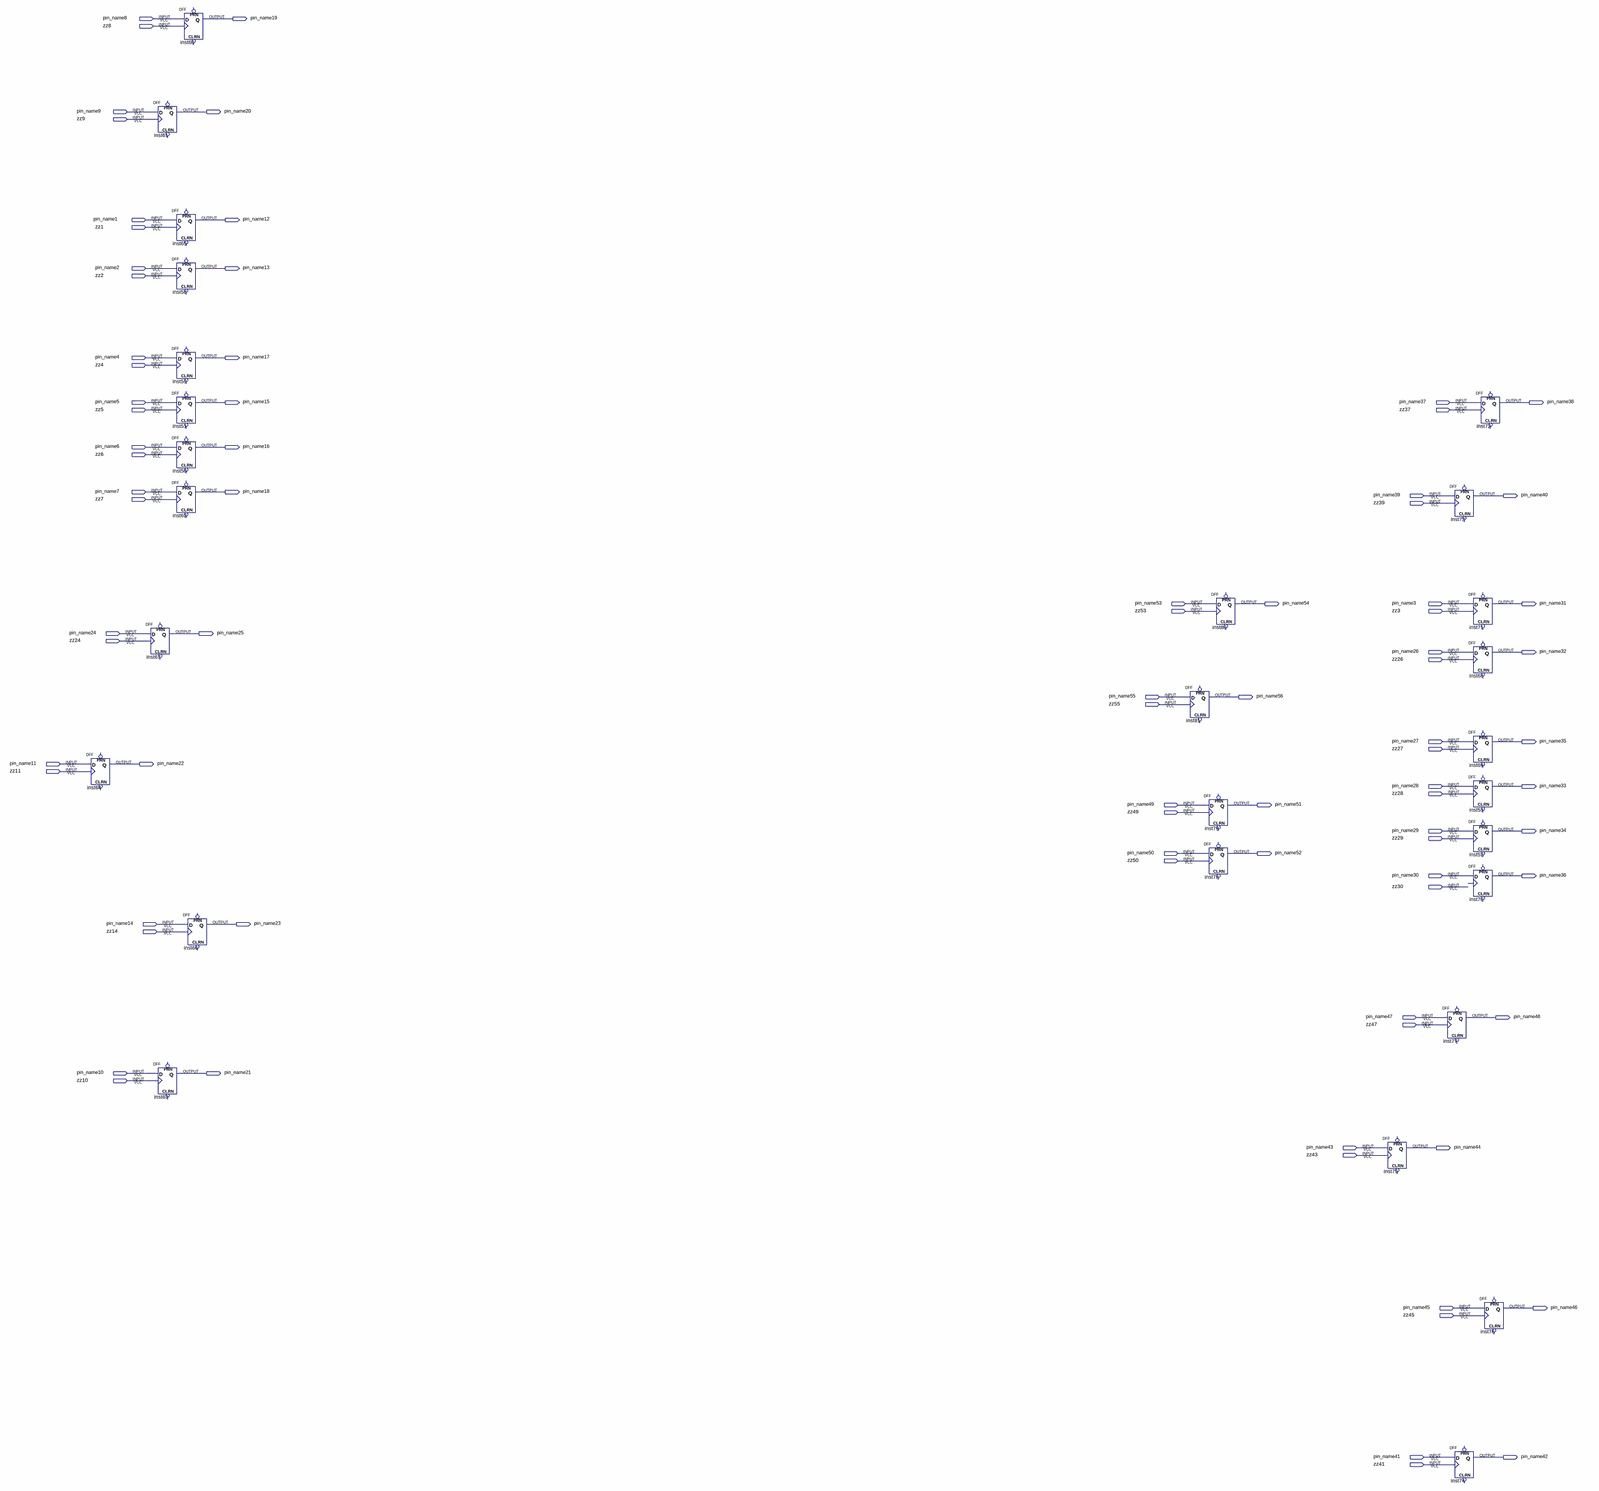
[diagram p0: schematic sheet, whole]
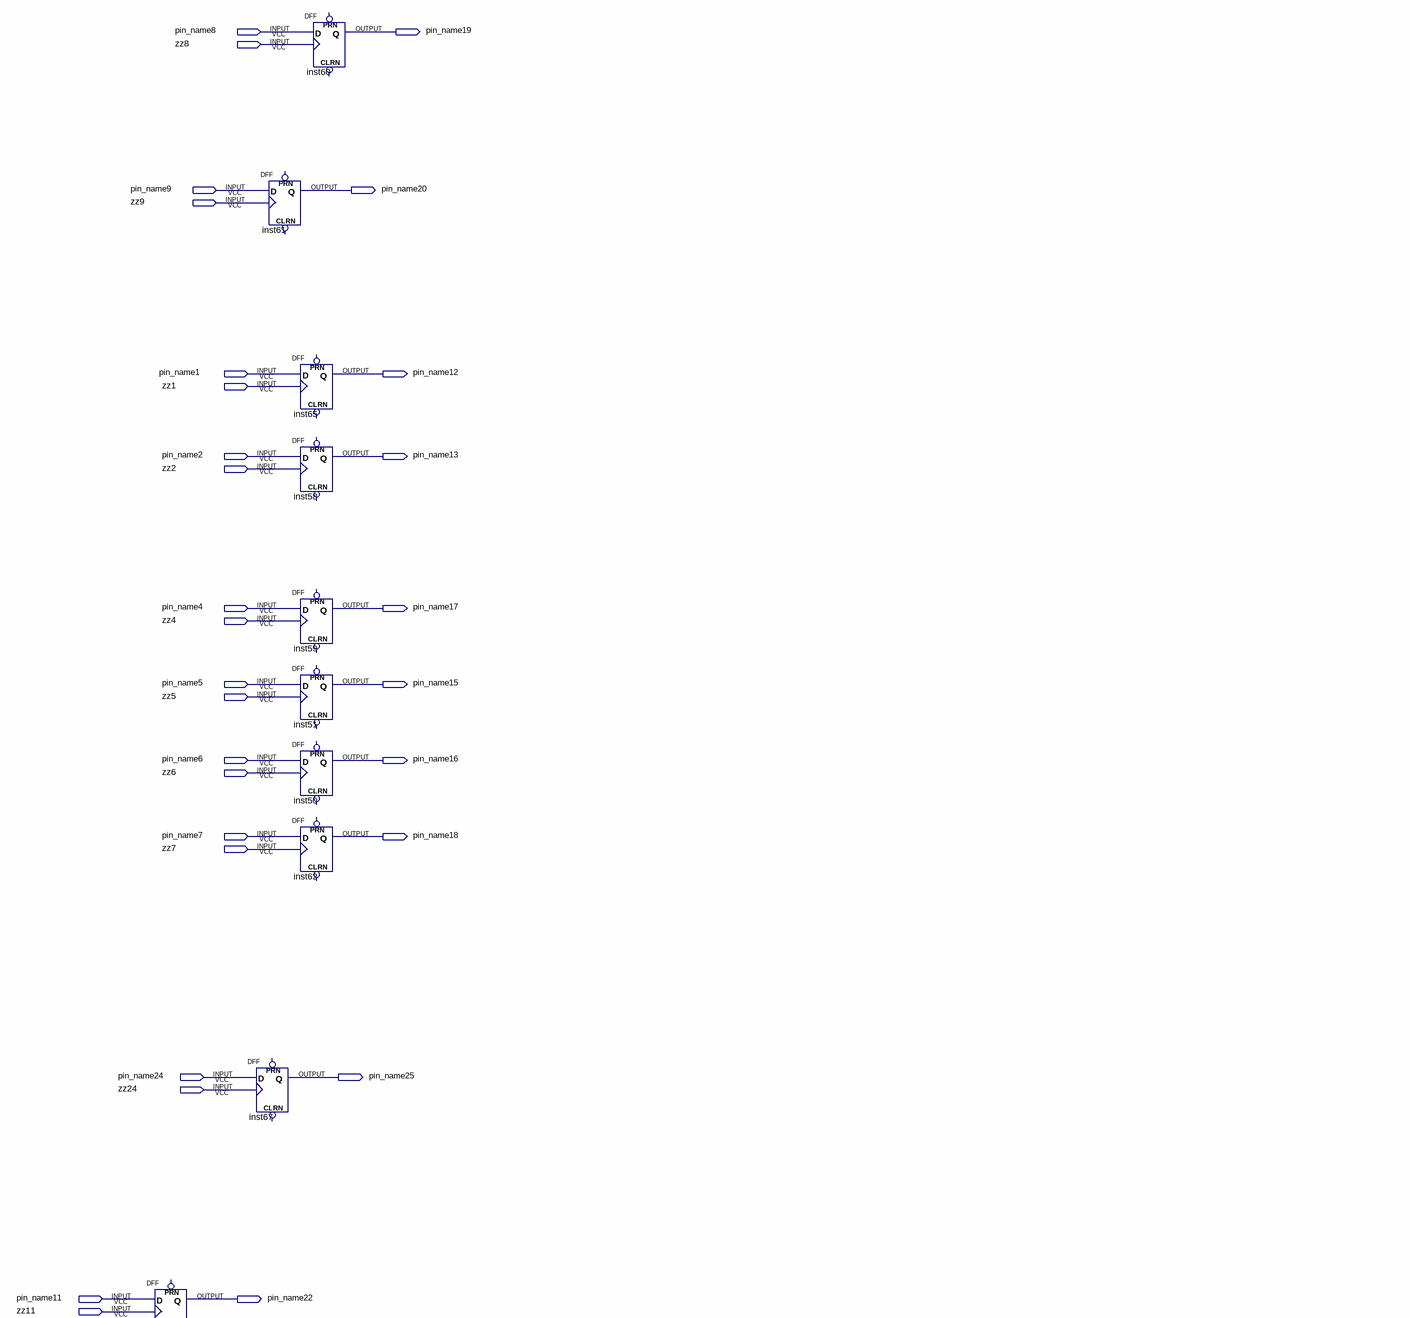
[diagram p1: schematic sheet, upper left part]
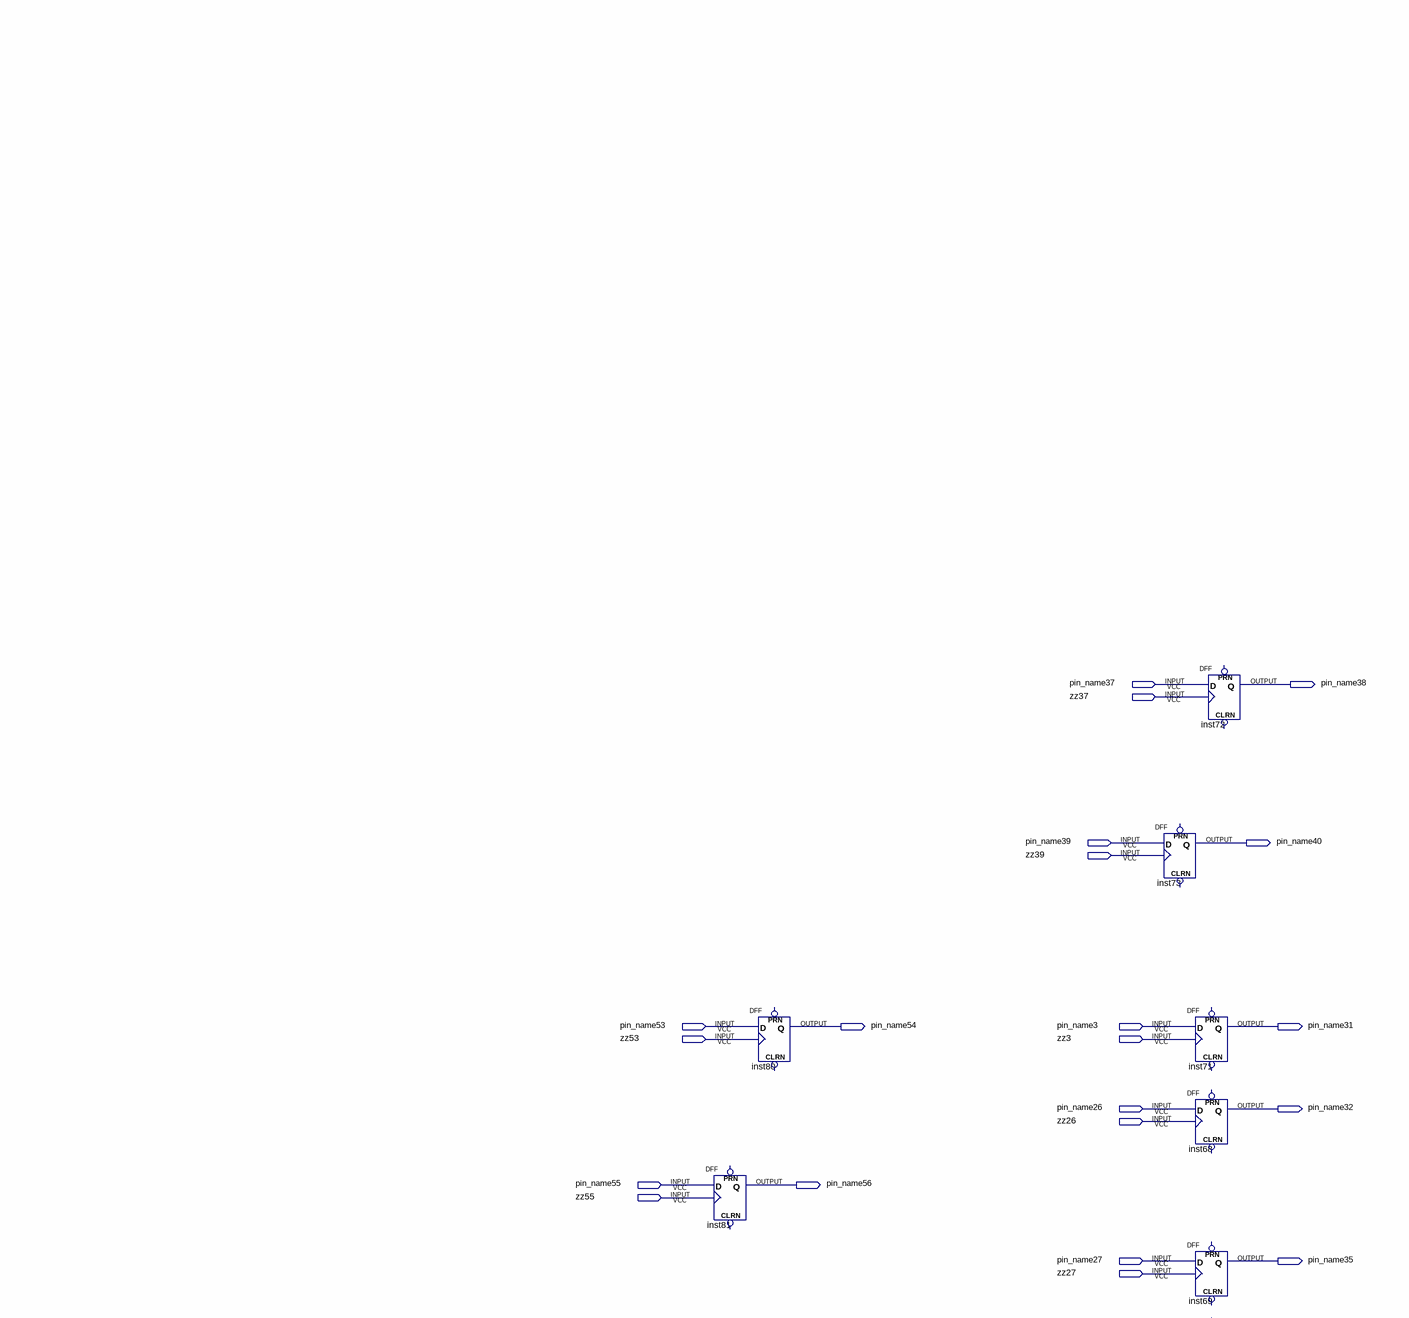
[diagram p2: schematic sheet, upper right part]
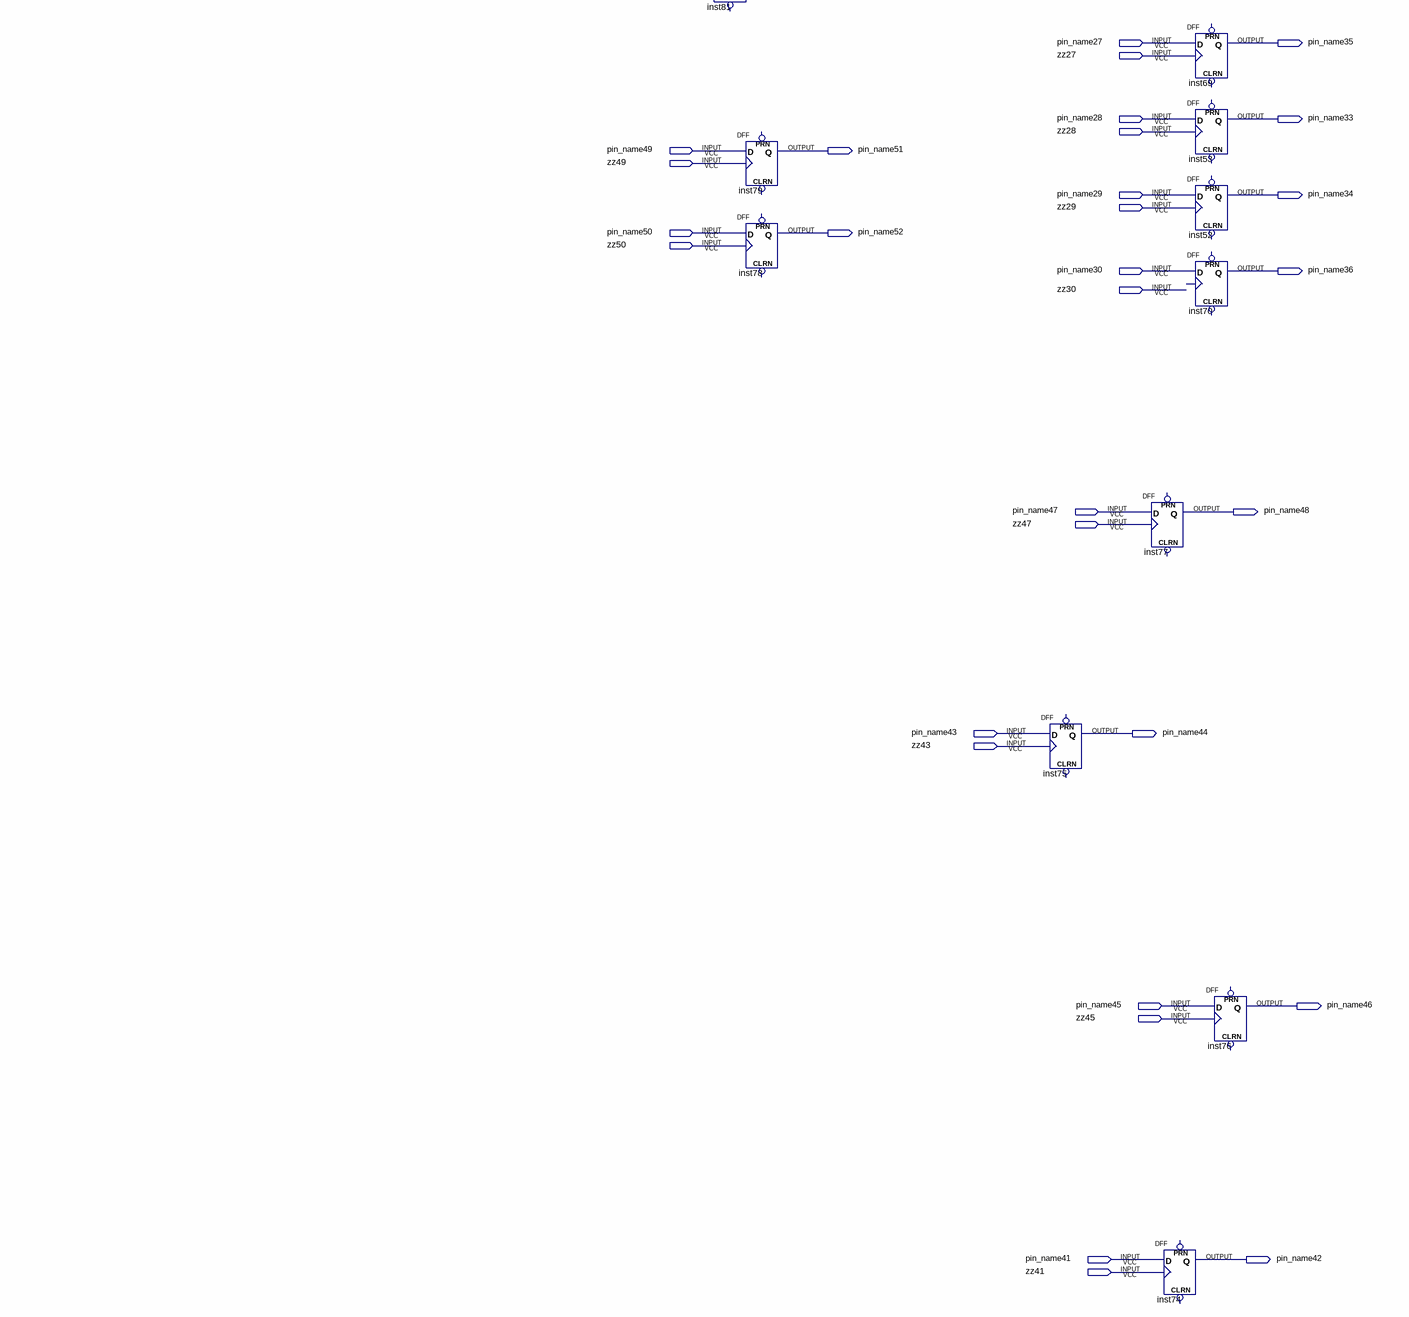
[diagram p3: schematic sheet, lower right part]
// Quartus schematic DFFMAX.bdf as structural Verilog: 28 symbols, 84 pins
module DFFMAX (
  input  pin_name8,
  input  zz8,
  input  pin_name9,
  input  zz9,
  input  pin_name1,
  input  zz1,
  input  pin_name2,
  input  zz2,
  input  pin_name4,
  input  zz4,
  input  pin_name5,
  input  pin_name37,
  input  zz5,
  input  zz37,
  input  pin_name6,
  input  zz6,
  input  pin_name7,
  input  pin_name39,
  input  zz7,
  input  zz39,
  input  pin_name53,
  input  pin_name3,
  input  zz53,
  input  zz3,
  input  pin_name24,
  input  zz24,
  input  pin_name26,
  input  zz26,
  input  pin_name55,
  input  zz55,
  input  pin_name27,
  input  zz27,
  input  pin_name11,
  input  zz11,
  input  pin_name28,
  input  zz28,
  input  pin_name49,
  input  zz49,
  input  pin_name29,
  input  zz29,
  input  pin_name50,
  input  zz50,
  input  pin_name30,
  input  zz30,
  input  pin_name14,
  input  zz14,
  input  pin_name47,
  input  zz47,
  input  pin_name10,
  input  zz10,
  input  pin_name43,
  input  zz43,
  input  pin_name45,
  input  zz45,
  input  pin_name41,
  input  zz41,
  output pin_name19,
  output pin_name20,
  output pin_name12,
  output pin_name13,
  output pin_name17,
  output pin_name15,
  output pin_name38,
  output pin_name16,
  output pin_name18,
  output pin_name40,
  output pin_name54,
  output pin_name31,
  output pin_name25,
  output pin_name32,
  output pin_name56,
  output pin_name35,
  output pin_name22,
  output pin_name33,
  output pin_name51,
  output pin_name34,
  output pin_name52,
  output pin_name36,
  output pin_name23,
  output pin_name48,
  output pin_name21,
  output pin_name44,
  output pin_name46,
  output pin_name42
);

  DFF inst64 (.CLK(zz11), .D(pin_name11), .Q(pin_name22));  // open: CLRN, PRN
  DFF inst61 (.CLK(zz9), .D(pin_name9), .Q(pin_name20));  // open: CLRN, PRN
  DFF inst67 (.CLK(zz24), .D(pin_name24), .Q(pin_name25));  // open: CLRN, PRN
  DFF inst63 (.CLK(zz10), .D(pin_name10), .Q(pin_name21));  // open: CLRN, PRN
  DFF inst60 (.CLK(zz8), .D(pin_name8), .Q(pin_name19));  // open: CLRN, PRN
  DFF inst65 (.CLK(zz1), .D(pin_name1), .Q(pin_name12));  // open: CLRN, PRN
  DFF inst58 (.CLK(zz2), .D(pin_name2), .Q(pin_name13));  // open: CLRN, PRN
  DFF inst59 (.CLK(zz4), .D(pin_name4), .Q(pin_name17));  // open: CLRN, PRN
  DFF inst51 (.CLK(zz5), .D(pin_name5), .Q(pin_name15));  // open: CLRN, PRN
  DFF inst50 (.CLK(zz6), .D(pin_name6), .Q(pin_name16));  // open: CLRN, PRN
  DFF inst62 (.CLK(zz7), .D(pin_name7), .Q(pin_name18));  // open: CLRN, PRN
  DFF inst66 (.CLK(zz14), .D(pin_name14), .Q(pin_name23));  // open: CLRN, PRN
  DFF inst81 (.CLK(zz55), .D(pin_name55), .Q(pin_name56));  // open: CLRN, PRN
  DFF inst79 (.CLK(zz49), .D(pin_name49), .Q(pin_name51));  // open: CLRN, PRN
  DFF inst78 (.CLK(zz50), .D(pin_name50), .Q(pin_name52));  // open: CLRN, PRN
  DFF inst80 (.CLK(zz53), .D(pin_name53), .Q(pin_name54));  // open: CLRN, PRN
  DFF inst75 (.CLK(zz43), .D(pin_name43), .Q(pin_name44));  // open: CLRN, PRN
  DFF inst77 (.CLK(zz47), .D(pin_name47), .Q(pin_name48));  // open: CLRN, PRN
  DFF inst73 (.CLK(zz39), .D(pin_name39), .Q(pin_name40));  // open: CLRN, PRN
  DFF inst71 (.CLK(zz3), .D(pin_name3), .Q(pin_name31));  // open: CLRN, PRN
  DFF inst68 (.CLK(zz26), .D(pin_name26), .Q(pin_name32));  // open: CLRN, PRN
  DFF inst69 (.CLK(zz27), .D(pin_name27), .Q(pin_name35));  // open: CLRN, PRN
  DFF inst53 (.CLK(zz28), .D(pin_name28), .Q(pin_name33));  // open: CLRN, PRN
  DFF inst52 (.CLK(zz29), .D(pin_name29), .Q(pin_name34));  // open: CLRN, PRN
  DFF inst70 (.D(pin_name30), .Q(pin_name36));  // open: CLRN, CLK, PRN
  DFF inst74 (.CLK(zz41), .D(pin_name41), .Q(pin_name42));  // open: CLRN, PRN
  DFF inst72 (.CLK(zz37), .D(pin_name37), .Q(pin_name38));  // open: CLRN, PRN
  DFF inst76 (.CLK(zz45), .D(pin_name45), .Q(pin_name46));  // open: CLRN, PRN
endmodule
